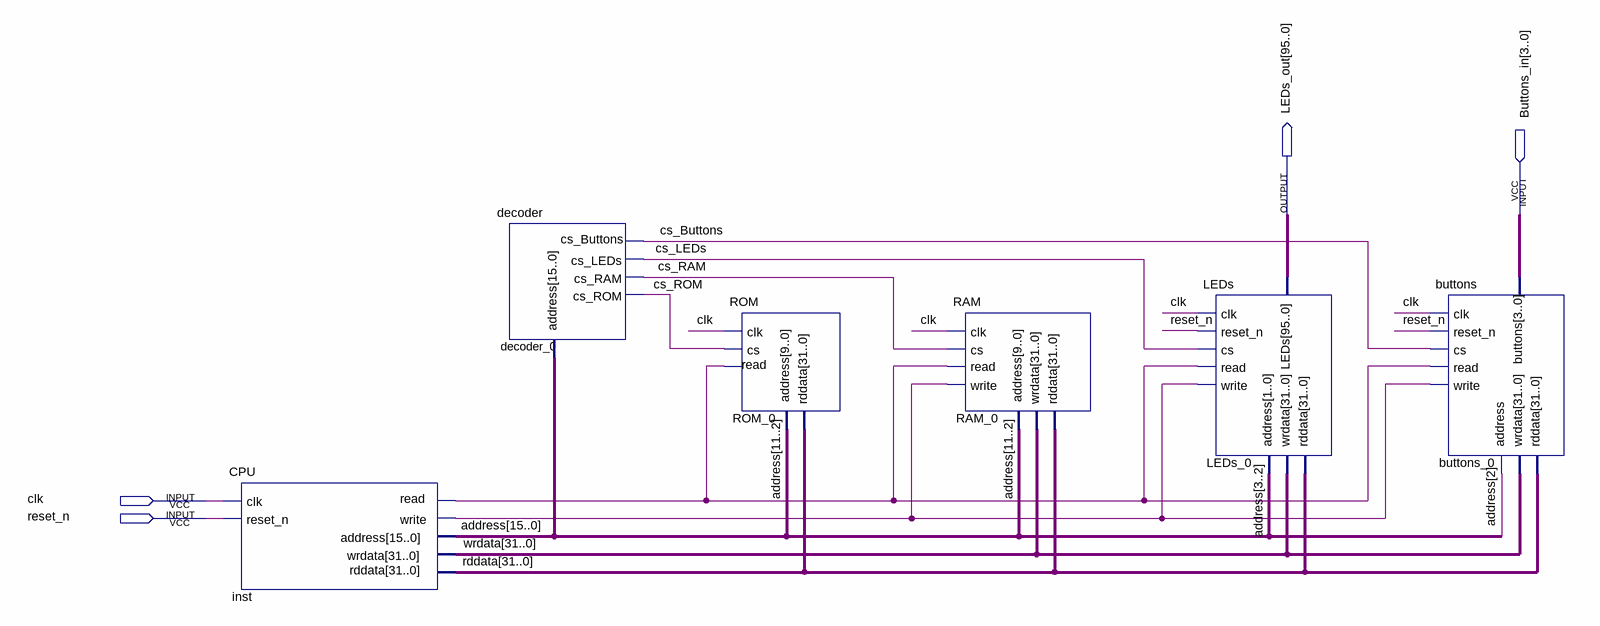
[diagram p0: schematic sheet]
// Quartus schematic System.bdf as structural Verilog: 6 symbols, 4 pins
module System (
  input  [3:0] Buttons_in,
  input  clk,
  input  reset_n,
  output [95:0] LEDs_out
);

  wire cs_Buttons, cs_LEDs, cs_RAM, cs_ROM, inst_read, inst_write;
  wire [15:0] address;
  wire [31:0] rddata, wrdata;

  CPU inst (
    .clk(clk), .reset_n(reset_n), .rddata(rddata), .write(inst_write), .wrdata(wrdata), .address(address),
    .read(inst_read));
  decoder decoder_0 (.address(address), .cs_RAM(cs_RAM), .cs_ROM(cs_ROM), .cs_Buttons(cs_Buttons), .cs_LEDs(cs_LEDs));
  ROM ROM_0 (.clk(clk), .cs(cs_ROM), .read(inst_read), .address(address[11:2]), .rddata(rddata));
  RAM RAM_0 (
    .clk(clk), .cs(cs_RAM), .write(inst_write), .wrdata(wrdata), .read(inst_read), .address(address[11:2]),
    .rddata(rddata));
  LEDs LEDs_0 (
    .clk(clk), .reset_n(reset_n), .cs(cs_LEDs), .write(inst_write), .address(address[3:2]), .wrdata(wrdata),
    .read(inst_read), .rddata(rddata), .LEDs(LEDs_out));
  buttons buttons_0 (
    .clk(clk), .reset_n(reset_n), .cs(cs_Buttons), .read(inst_read), .write(inst_write),
    .address(address[2]), .wrdata(wrdata), .buttons(Buttons_in), .rddata(rddata));
endmodule
